# EAGLE schematic senderNode_tiny84 (EAGLE 6.6.0)
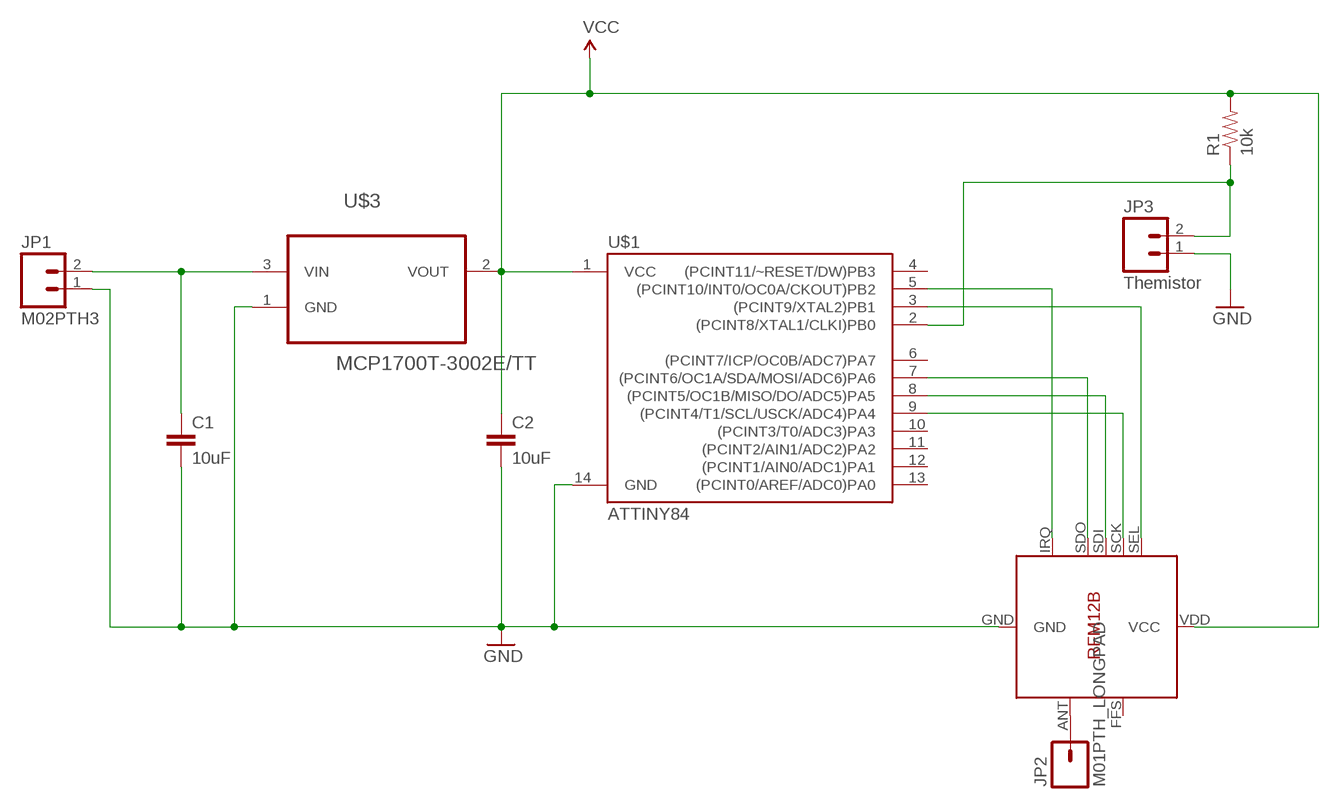
[diagram p0: schematic, sheet 1]

## Parts
C1  10uF  10UF-6.3V-20%(0603)  [0603-CAP]
C2  10uF  10UF-6.3V-20%(0603)  [0603-CAP]
JP1  M02PTH3  [1X02_LONGPADS]
JP2  M01PTH_LONGPAD  [1X01_LONGPAD]
JP3  Themistor  M02PTH3  [1X02_LONGPADS]
R1  10k  RESISTOR0805-RES  [0805]
U$1  ATTINY84  [SO14]
U$2  RFM12B  [RFM12B]
U$3  MCP1700T-3002E/TT  [SOT95P237X112-3N]

## Nets
GND: C1.2 C2.2 JP1.1 JP3.1 U$1.14(GND) U$2.GND U$3.1(GND)
N$1: U$1.5((PCINT10/INT0/OC0A/CKOUT)PB2) U$2.IRQ
N$2: U$1.7((PCINT6/OC1A/SDA/MOSI/ADC6)PA6) U$2.SDO
N$3: U$1.8((PCINT5/OC1B/MISO/DO/ADC5)PA5) U$2.SDI
N$4: U$1.9((PCINT4/T1/SCL/USCK/ADC4)PA4) U$2.SCK
N$5: U$1.3((PCINT9/XTAL2)PB1) U$2.SEL
N$6: C1.1 JP1.2 U$3.3(VIN)
N$9: JP3.2 R1.1 U$1.2((PCINT8/XTAL1/CLKI)PB0)
N$10: JP2.1 U$2.ANT
VCC: C2.1 R1.2 U$1.1(VCC) U$2.VDD(VCC) U$3.2(VOUT)
Unconnected: U$1.4((PCINT11/~RESET/DW)PB3) U$1.6((PCINT7/ICP/OC0B/ADC7)PA7) U$1.10((PCINT3/T0/ADC3)PA3) U$1.11((PCINT2/AIN1/ADC2)PA2) U$1.12((PCINT1/AIN0/ADC1)PA1) U$1.13((PCINT0/AREF/ADC0)PA0) U$2.FFS

## Library data of the parts
C1 C2 = SparkFun-Capacitors:10UF-6.3V-20%(0603): CAP-11015; PROD_ID: CAP-11015
JP1 JP3 = SparkFun-Connectors:M02: Standard 2-pin 0.1" header. Use with - straight break away headers ( PRT-00116) - right angle break away headers (PRT-00553) - swiss pins (PRT-00743) - machine pins (PRT-00117) - female headers (PRT-00115) Molex polarized connector foot print use with: PRT-08233 with associated crimp pins and housings. 2.54_SCREWTERM for use with PRT-10571. 3.5mm Screw Terminal footprints for PRT-08084 5mm Screw Terminal footprints for use with PRT-08433
JP2 = SparkFun-Connectors:M01: Header 1 Standard 1-pin 0.1" header. Use with straight break away headers (SKU : PRT-00116), right angle break away headers (PRT-00553), swiss pins (PRT-00743), machine pins (PRT-00117), and female headers (PRT-00115).
R1 = SparkFun-Resistors:RESISTOR: Resistor Basic schematic elements and footprints for 0603, 1206, and PTH resistors.
U$1 = SparkFun-DigitalIC:ATTINY84: Atmel 14-pin 2/4/8kB flash uC
U$2 = JeeParts:RFM12B
U$3 = Microchip_By_element14_Batch_1:MCP1700T-3002E/TT: Low Quiescent Current LDO; MPN: MCP1700T-3002E/TT; OC_FARNELL: 1331482; OC_NEWARK: 84R5176; PACKAGE: SOT23-3; SUPPLIER: Microchip